# Altium schematic sheet P01_Top Level.SchDoc
size A4; SheetNumber: 1; SheetTotal: 7
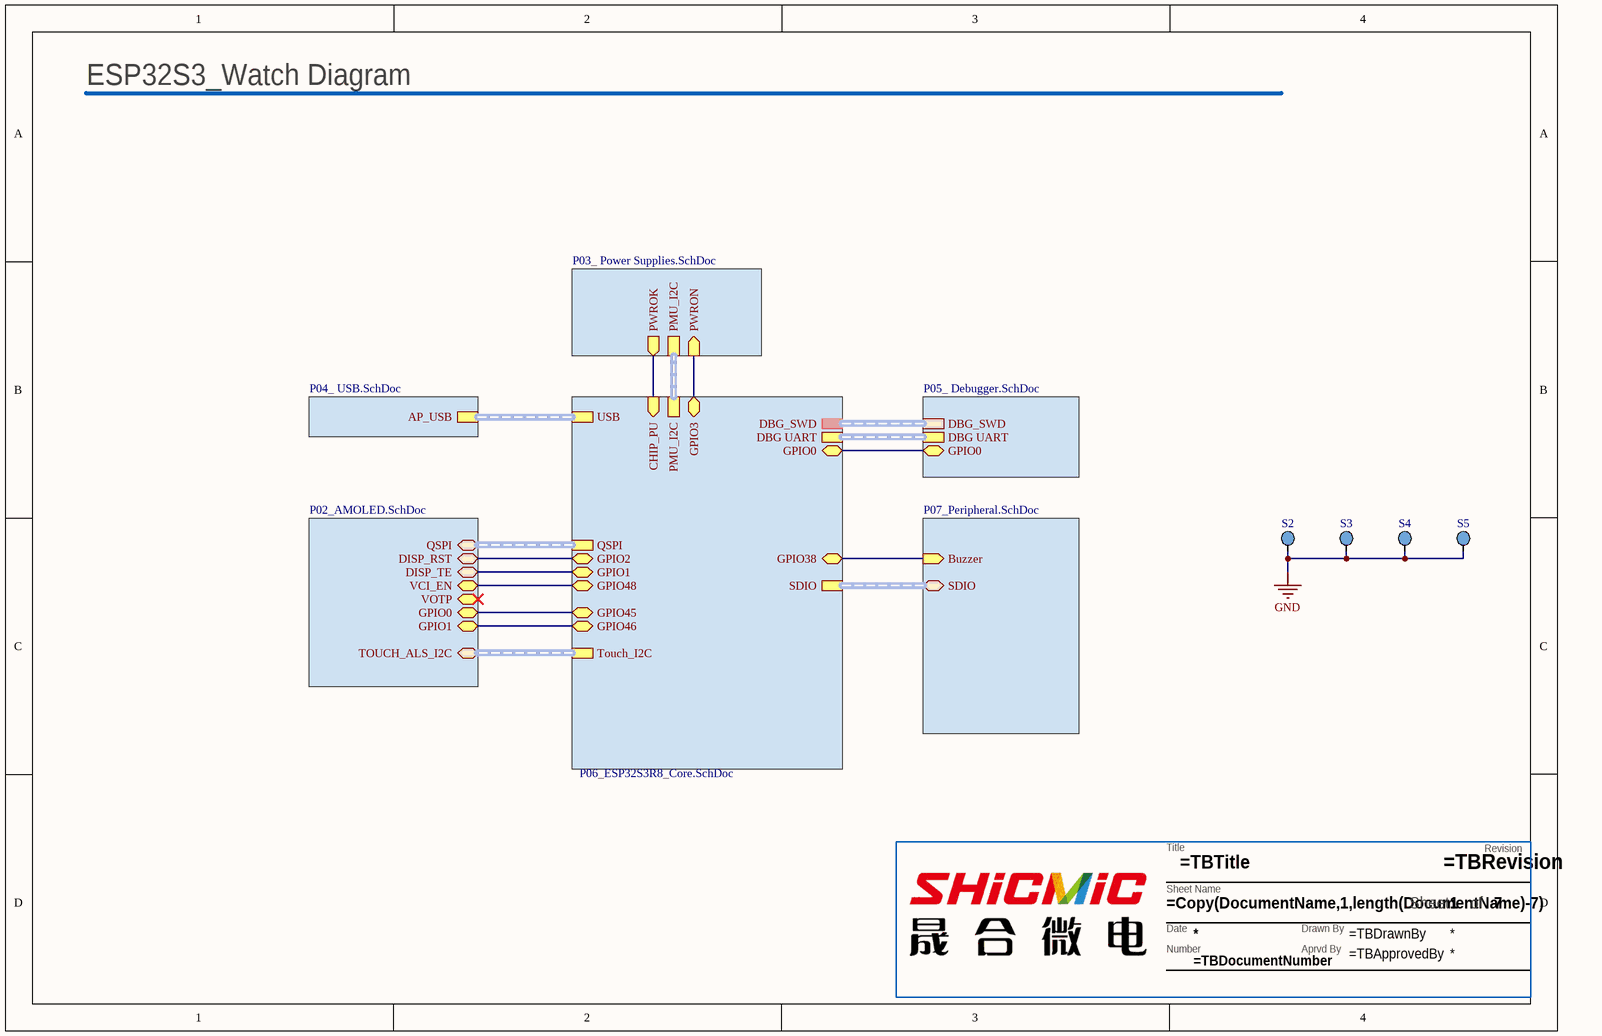
[diagram p0: P01_Top Level.SchDoc]

## Parts
?  TitleBlock  (value not drawn)  (graphical)
S2  Screw_2.9  [HOLE-3.2MM_M]  (value not drawn)
S3  Screw_2.9  [HOLE-3.2MM_M]  (value not drawn)
S4  Screw_2.9  [HOLE-3.2MM_M]  (value not drawn)
S5  Screw_2.9  [HOLE-3.2MM_M]  (value not drawn)

## Sub-sheets
P07_Peripheral = P07_Peripheral.SchDoc: SDIO (bidir, harness SDIO), Buzzer (in)
U_P02_ AMOLED = P02_AMOLED.SchDoc: QSPI (bidir, harness QSPI), DISP_TE (bidir), TOUCH_ALS_I2C (bidir, harness TOUCH_ALS_I2C), DISP_RST (bidir), VOTP (bidir), VCI_EN (bidir), GPIO0 (bidir), GPIO1 (bidir)
U_P03_ Power Supplies = P03_ Power Supplies.SchDoc: PWROK (out), PMU_I2C (harness PMU_I2C), PWRON (in)
U_P04_ USB = P04_ USB.SchDoc: AP_USB (harness USB)
U_P05_ Debugger = P05_ Debugger.SchDoc: DBG_SWD (harness SWD), DBG UART (harness UART), GPIO0 (bidir)
U_P06_ Apollo4B_core = P06_ESP32S3R8_Core.SchDoc: QSPI (harness QSPI), SDIO (harness SDIO), USB (harness USB), DBG_SWD (harness SWD), Touch_I2C (harness TOUCH_ALS_I2C), DBG UART (harness UART), PMU_I2C (harness PMU_I2C), GPIO0 (bidir), GPIO38 (bidir), GPIO1 (bidir), CHIP_PU (in), GPIO48 (bidir), GPIO2 (bidir), GPIO3 (bidir), GPIO45 (bidir), GPIO46 (bidir)

## Nets
GND: S2.1 S3.1 S4.1 S5.1
(unnamed): sheet U_P06_ Apollo4B_core/GPIO0, sheet U_P05_ Debugger/GPIO0
(unnamed): sheet U_P06_ Apollo4B_core/GPIO38, sheet P07_Peripheral/Buzzer
(unnamed): sheet U_P06_ Apollo4B_core/GPIO1, sheet U_P02_ AMOLED/DISP_TE
(unnamed): sheet U_P06_ Apollo4B_core/CHIP_PU, sheet U_P03_ Power Supplies/PWROK
(unnamed): sheet U_P06_ Apollo4B_core/GPIO48, sheet U_P02_ AMOLED/VCI_EN
(unnamed): sheet U_P06_ Apollo4B_core/GPIO2, sheet U_P02_ AMOLED/DISP_RST
(unnamed): sheet U_P06_ Apollo4B_core/GPIO3, sheet U_P03_ Power Supplies/PWRON
(unnamed): sheet U_P06_ Apollo4B_core/GPIO45, sheet U_P02_ AMOLED/GPIO0
(unnamed): sheet U_P06_ Apollo4B_core/GPIO46, sheet U_P02_ AMOLED/GPIO1

## Buses and harness runs
harness sheet P07_Peripheral/SDIO = sheet U_P06_ Apollo4B_core/SDIO
harness sheet U_P02_ AMOLED/QSPI = sheet U_P06_ Apollo4B_core/QSPI
harness sheet U_P02_ AMOLED/TOUCH_ALS_I2C = sheet U_P06_ Apollo4B_core/Touch_I2C
harness sheet U_P03_ Power Supplies/PMU_I2C = sheet U_P06_ Apollo4B_core/PMU_I2C
harness sheet U_P04_ USB/AP_USB = sheet U_P06_ Apollo4B_core/USB
harness sheet U_P05_ Debugger/DBG UART = sheet U_P06_ Apollo4B_core/DBG UART
harness sheet U_P05_ Debugger/DBG_SWD = sheet U_P06_ Apollo4B_core/DBG_SWD

## Notes on the sheet
- ESP32S3_Watch Diagram
- (in symbol TitleBlock) Revision; Title; Sheet Name; Sheet; of; Date; Drawn By; Number; Aprvd By

## Library data of the parts
? = TitleBlock: Title block for Ambiq Schematics. Please have the following parameters entered in Project>Project Options>Parameters: / TBTitle / TBDocumentNumber / TBRevision / TBDrawnBy / TBApprovedBy; AMBIQ PN: TitleBlock